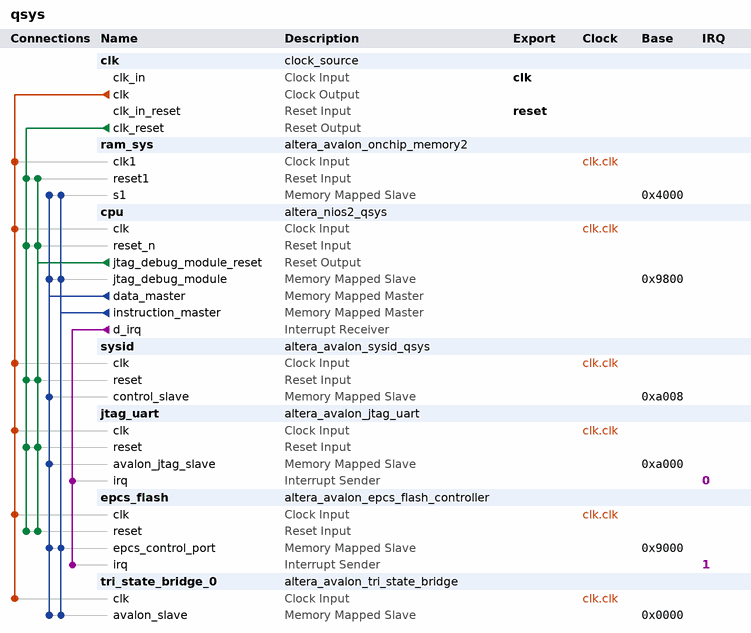
[diagram p0: system contents]
# Platform Designer (Qsys) system qsys, Cyclone II EP2C35F672C6
# Parameters at their usual value, and those the tool derives, are not listed.
package require -exact qsys 13.0
create_system qsys
set_project_property DEVICE_FAMILY {Cyclone II}
set_project_property DEVICE EP2C35F672C6

add_instance clk clock_source 13.0
set_instance_parameter_value clk clockFrequency 50000000

add_instance ram_sys altera_avalon_onchip_memory2 13.0.1.99.2
set_instance_parameter_value ram_sys dataWidth 32
set_instance_parameter_value ram_sys dualPort false
set_instance_parameter_value ram_sys initMemContent true
set_instance_parameter_value ram_sys initializationFileName onchip_mem.hex
set_instance_parameter_value ram_sys instanceID sys
set_instance_parameter_value ram_sys memorySize 16384

add_instance cpu altera_nios2_qsys 13.0
set_instance_parameter_value cpu resetSlave epcs_flash.epcs_control_port
set_instance_parameter_value cpu mmu_TLBMissExcSlave None
set_instance_parameter_value cpu exceptionSlave ram_sys.s1
set_instance_parameter_value cpu breakSlave cpu.jtag_debug_module
set_instance_parameter_value cpu impl Tiny
set_instance_parameter_value cpu icache_size 4096

add_instance sysid altera_avalon_sysid_qsys 13.0
set_instance_parameter_value sysid id 170

add_instance jtag_uart altera_avalon_jtag_uart 13.0.1.99.2
set_instance_parameter_value jtag_uart simInteractiveOptions NO_INTERACTIVE_WINDOWS

add_instance epcs_flash altera_avalon_epcs_flash_controller 13.0.1.99.2

add_instance tri_state_bridge_0 altera_avalon_tri_state_bridge 13.0
set_instance_parameter_value tri_state_bridge_0 registerIncomingSignals true

# connections
add_connection clk.clk cpu.clk clock
add_connection clk.clk epcs_flash.clk clock
add_connection clk.clk jtag_uart.clk clock
add_connection clk.clk ram_sys.clk1 clock
add_connection clk.clk sysid.clk clock
add_connection clk.clk tri_state_bridge_0.clk clock
add_connection clk.clk_reset cpu.reset_n reset
add_connection clk.clk_reset epcs_flash.reset reset
add_connection clk.clk_reset jtag_uart.reset reset
add_connection clk.clk_reset ram_sys.reset1 reset
add_connection clk.clk_reset sysid.reset reset
add_connection cpu.jtag_debug_module_reset cpu.reset_n reset
add_connection cpu.jtag_debug_module_reset epcs_flash.reset reset
add_connection cpu.jtag_debug_module_reset jtag_uart.reset reset
add_connection cpu.jtag_debug_module_reset ram_sys.reset1 reset
add_connection cpu.jtag_debug_module_reset sysid.reset reset
add_connection cpu.data_master cpu.jtag_debug_module avalon
set_connection_parameter_value cpu.data_master/cpu.jtag_debug_module baseAddress 0x9800
add_connection cpu.data_master epcs_flash.epcs_control_port avalon
set_connection_parameter_value cpu.data_master/epcs_flash.epcs_control_port baseAddress 0x9000
add_connection cpu.data_master jtag_uart.avalon_jtag_slave avalon
set_connection_parameter_value cpu.data_master/jtag_uart.avalon_jtag_slave baseAddress 0xa000
add_connection cpu.data_master ram_sys.s1 avalon
set_connection_parameter_value cpu.data_master/ram_sys.s1 baseAddress 0x4000
add_connection cpu.data_master sysid.control_slave avalon
set_connection_parameter_value cpu.data_master/sysid.control_slave baseAddress 0xa008
add_connection cpu.data_master tri_state_bridge_0.avalon_slave avalon
set_connection_parameter_value cpu.data_master/tri_state_bridge_0.avalon_slave baseAddress 0x0000
add_connection cpu.instruction_master cpu.jtag_debug_module avalon
set_connection_parameter_value cpu.instruction_master/cpu.jtag_debug_module baseAddress 0x9800
add_connection cpu.instruction_master epcs_flash.epcs_control_port avalon
set_connection_parameter_value cpu.instruction_master/epcs_flash.epcs_control_port baseAddress 0x9000
add_connection cpu.instruction_master ram_sys.s1 avalon
set_connection_parameter_value cpu.instruction_master/ram_sys.s1 baseAddress 0x4000
add_connection cpu.instruction_master tri_state_bridge_0.avalon_slave avalon
set_connection_parameter_value cpu.instruction_master/tri_state_bridge_0.avalon_slave baseAddress 0x0000
add_connection cpu.d_irq epcs_flash.irq interrupt
set_connection_parameter_value cpu.d_irq/epcs_flash.irq irqNumber 1
add_connection cpu.d_irq jtag_uart.irq interrupt
set_connection_parameter_value cpu.d_irq/jtag_uart.irq irqNumber 0

# exported interfaces
add_interface clk clock sink
set_interface_property clk EXPORT_OF clk.clk_in
add_interface reset reset sink
set_interface_property reset EXPORT_OF clk.clk_in_reset

set_interconnect_requirement {$system} qsys_mm.clockCrossingAdapter HANDSHAKE
set_interconnect_requirement {$system} qsys_mm.maxAdditionalLatency 1

save_system qsys.qsys
